# EAGLE design winderController02 (EAGLE 9.3.1)
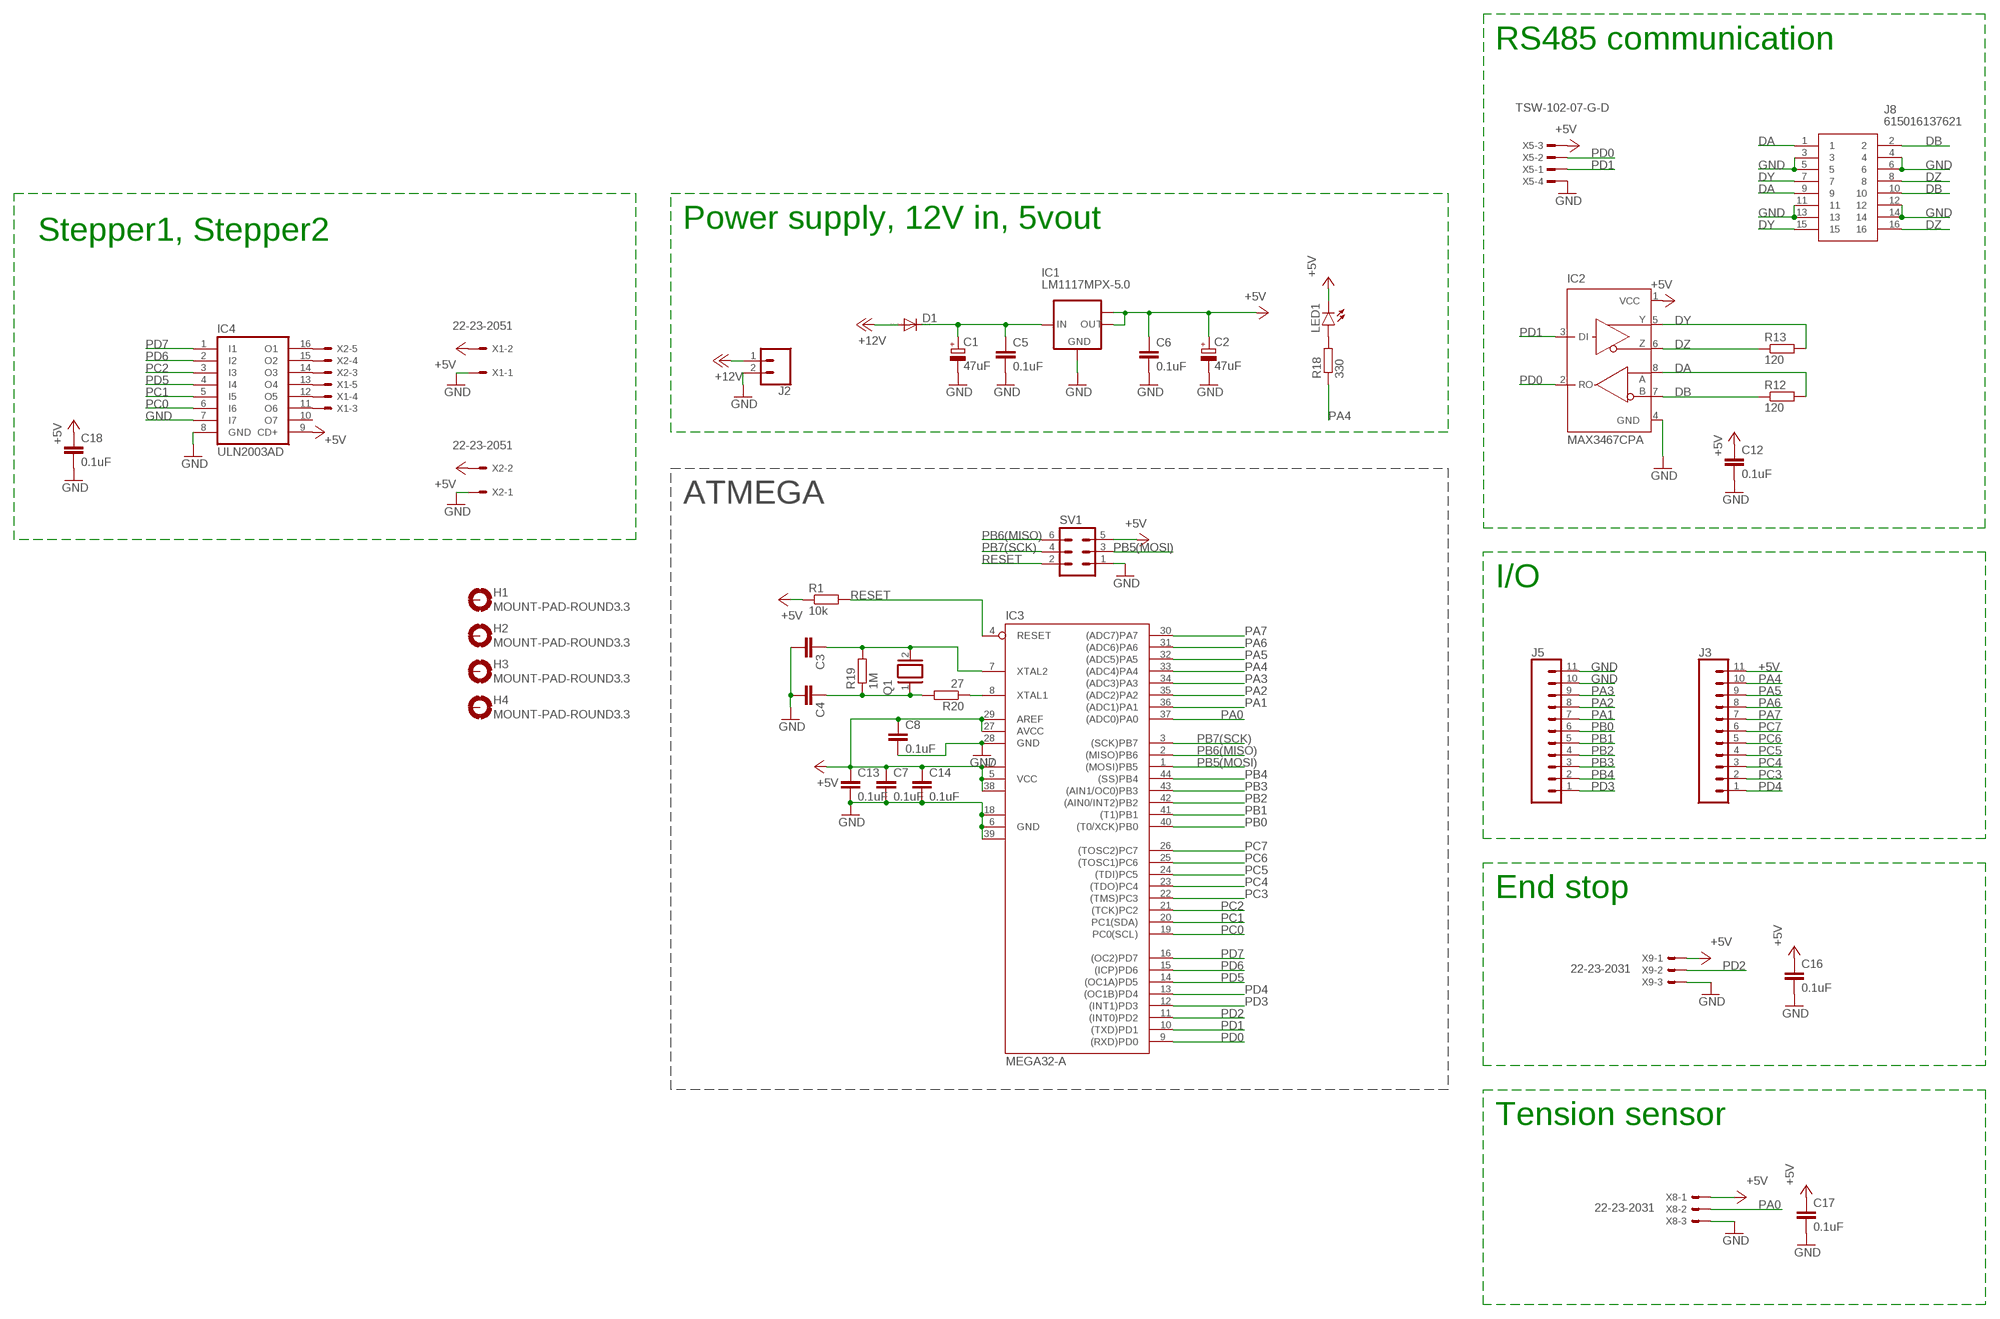
[diagram p0: schematic, sheet 1]

## Parts
C1  47uF  CPOL-EUD  [PANASONIC_D]
C2  47uF  CPOL-EUD  [PANASONIC_D]
C3  C-EUC0603  [C0603]
C4  C-EUC0603  [C0603]
C5  0.1uF  C-EUC0603  [C0603]
C6  0.1uF  C-EUC0603  [C0603]
C7  0.1uF  C-EUC0603  [C0603]
C8  0.1uF  C-EUC0603  [C0603]
C12  0.1uF  C-EUC0603  [C0603]
C13  0.1uF  C-EUC0603  [C0603]
C14  0.1uF  C-EUC0603  [C0603]
C16  0.1uF  C-EUC0603  [C0603]
C17  0.1uF  C-EUC0603  [C0603]
C18  0.1uF  C-EUC0603  [C0603]
D1  DIODE-SMB  [SMB]
H1  MOUNT-PAD-ROUND3.3  [3,3-PAD]
H2  MOUNT-PAD-ROUND3.3  [3,3-PAD]
H3  MOUNT-PAD-ROUND3.3  [3,3-PAD]
H4  MOUNT-PAD-ROUND3.3  [3,3-PAD]
IC1  LM1117MPX-5.0  [SOT223]
IC2  MAX3467CPA  [SO08]
IC3  MEGA32-A  [TQFP44]
IC4  ULN2003AD  [SO16]
J2  CONN_023.5MM  [SCREWTERMINAL-3.5MM-2]
J3  CONN_11  [1X11]
J5  CONN_11  [1X11]
J8  615016137621  [WR-MJ]
LED1  LEDSML1206  [SML1206]
Q1  XTAL/S  [QS]
R1  10k  R-EU_R0805  [R0805]
R12  120  R-EU_R1210  [R1210]
R13  120  R-EU_R1210  [R1210]
R18  330  R-EU_R0805  [R0805]
R19  1M  R-EU_R0805  [R0805]
R20  27  R-EU_R0805  [R0805]
SV1  MA03-2  [MA03-2]
X1  22-23-2051  [22-23-2051]
X2  22-23-2051  [22-23-2051]
X5  TSW-102-07-G-D  [TSW-102-XX-G-D]
X8  22-23-2031  [22-23-2031]
X9  22-23-2031  [22-23-2031]

## Nets
+5V: C2.+ C6.1 C7.1 C8.1 C12.1 C13.1 C14.1 C16.1 C17.1 C18.1 IC1.2(OUT) IC1.TAB(OUT1) IC2.1(VCC) IC3.5(VCC) IC3.17(VCC1) IC3.27(AVCC) IC3.29(AREF) IC3.38(VCC2) IC4.9(CD+) J3.11 LED1.C R1.1 SV1.5 X1.2 X2.2 X5.3 X8.1 X9.1
+12V: D1.A J2.1
DA: IC2.8(A) J8.1 J8.9 R12.2
DB: IC2.7(B) J8.2 J8.10 R12.1
DY: IC2.5(Y) J8.7 J8.15 R13.2
DZ: IC2.6(Z) J8.8 J8.16 R13.1
GND: C1.- C2.- C3.2 C4.2 C5.2 C6.2 C7.2 C8.2 C12.2 C13.2 C14.2 C16.2 C17.2 C18.2 IC1.1(GND) IC2.4(GND) IC3.6(GND) IC3.18(GND1) IC3.28(GND) IC3.39(GND2) IC4.7(I7) IC4.8(GND) J2.2 J5.10 J5.11 J8.3 J8.4 J8.5 J8.6 J8.11 J8.12 J8.13 J8.14 SV1.1 X1.1 X2.1 X5.4 X8.3 X9.3
N$9: IC4.11(O6) X1.3
N$10: IC4.12(O5) X1.4
N$11: IC4.13(O4) X1.5
N$12: IC4.14(O3) X2.3
N$18: C1.+ C5.1 D1.C IC1.3(IN)
N$19: C3.1 IC3.7(XTAL2) Q1.2 R19.2
N$20: C4.1 Q1.1 R19.1 R20.2
N$28: IC4.15(O2) X2.4
N$29: IC4.16(O1) X2.5
N$35: IC3.8(XTAL1) R20.1
N$41: LED1.A R18.2
PA0: IC3.37((ADC0)PA0) X8.2
PA1: IC3.36((ADC1)PA1) J5.7
PA2: IC3.35((ADC2)PA2) J5.8
PA3: IC3.34((ADC3)PA3) J5.9
PA4: IC3.33((ADC4)PA4) J3.10 R18.1
PA5: IC3.32((ADC5)PA5) J3.9
PA6: IC3.31((ADC6)PA6) J3.8
PA7: IC3.30((ADC7)PA7) J3.7
PB0: IC3.40((T0/XCK)PB0) J5.6
PB1: IC3.41((T1)PB1) J5.5
PB2: IC3.42((AIN0/INT2)PB2) J5.4
PB3: IC3.43((AIN1/OC0)PB3) J5.3
PB4: IC3.44((SS)PB4) J5.2
PB5(MOSI): IC3.1((MOSI)PB5) SV1.3
PB6(MISO): IC3.2((MISO)PB6) SV1.6
PB7(SCK): IC3.3((SCK)PB7) SV1.4
PC0: IC3.19(PC0(SCL)) IC4.6(I6)
PC1: IC3.20(PC1(SDA)) IC4.5(I5)
PC2: IC3.21((TCK)PC2) IC4.3(I3)
PC3: IC3.22((TMS)PC3) J3.2
PC4: IC3.23((TDO)PC4) J3.3
PC5: IC3.24((TDI)PC5) J3.4
PC6: IC3.25((TOSC1)PC6) J3.5
PC7: IC3.26((TOSC2)PC7) J3.6
PD0: IC2.2(RO) IC3.9((RXD)PD0) X5.2
PD1: IC2.3(DI) IC3.10((TXD)PD1) X5.1
PD2: IC3.11((INT0)PD2) X9.2
PD3: IC3.12((INT1)PD3) J5.1
PD4: IC3.13((OC1B)PD4) J3.1
PD5: IC3.14((OC1A)PD5) IC4.4(I4)
PD6: IC3.15((ICP)PD6) IC4.2(I2)
PD7: IC3.16((OC2)PD7) IC4.1(I1)
RESET: IC3.4(RESET) R1.2 SV1.2
Unconnected: H1.B3,3(MOUNT) H2.B3,3(MOUNT) H3.B3,3(MOUNT) H4.B3,3(MOUNT) IC4.10(O7)

## Notes on the sheet
- RS485 communication
- Power supply, 12V in, 5vout
- Stepper1, Stepper2
- ATMEGA
- I/O
- End stop
- Tension sensor

## Library data of the parts
C1 C2 = rcl:CPOL-EU: POLARIZED CAPACITOR, European symbol; SPICEPREFIX: C
C3-C8 C12-C14 C16-C18 = rcl:C-EU: CAPACITOR, European symbol; SPICEPREFIX: C
D1 = diode:DIODE-: DIODE
H1-H4 = holes:MOUNT-PAD-ROUND: MOUNTING PAD, round
IC1 = lm1117:LM1117MPX-*
IC2 = maxim:MAX3467*: +5V, Fail-Safe, 40Mbps, Profibus RS-485/RS-422 Transceivers Source: MAX3465-MAX3469.pdf; OC_FARNELL: unknown; OC_NEWARK: unknown
IC3 = atmel:MEGA32: MICROCONTROLLER 32 Kbytes FLASH 2 Kbytes SRAM 1 Kbytes EEPROM USART 8-channel 10 bit ADC Source: www.atmel.com .. doc2503.pdf; MPN: ATMEGA32-16AU; OC_FARNELL: 9171274; OC_NEWARK: 69K6677
IC4 = uln-udn:ULN2003A: DRIVER ARRAY
J2 = SparkFun-Connectors:CONN_02: Multi connection point. Often used as Generic Header-pin footprint for 0.1 inch spaced/style header connections On any of the 0.1 inch spaced packages, you can populate with these: Break Away Headers - Straight <https://www.sparkfun.com/products/116> (PRT-00116) Break Away Male Headers - Right Angle <https://www.sparkfun.com/products/553> (PRT-00553) Female Headers <https://www.sparkfun.com/products/115> (PRT-00115) Break Away Headers - Machine Pin <https://www.sparkfun.com/products/117> (PRT-00117) Break Away Female Headers - Swiss Machine Pin <https://www.sparkfun.com/products/743> (PRT-00743) For SCREWTERMINALS and SPRING TERMINALS visit here: Screw Terimnals on SparkFun.com <https://www.sparkfun.com/search/results?term=Screw+Terminals> (5mm/3.5mm/2.54mm spacing) This device is also useful as a general connection point to wire up your design to another part of your project. Our various solder wires solder well into these plated through hole pads. Hook-Up Wire - Assortment (Stranded, 22 AWG) <https://www.sparkfun.com/products/11375> (PRT-11375) Hook-Up Wire - Assortment (Solid Core, 22 AWG) <https://www.sparkfun.com/products/11367> (PRT-11367) View the entire wire category on our website here <https://www.sparkfun.com/categories/141> Special notes: Molex polarized connector foot print use with: PRT-08233 with associated crimp pins and housings. 2.54_SCREWTERM for use with PRT-10571. 3.5mm Screw Terminal footprints for PRT-08084 5mm Screw Terminal footprints for use with PRT-08432; PROD_ID: CONN-08399
J3 J5 = SparkFun-Connectors:CONN_11: Multi connection point. Often used as Generic Header-pin footprint for 0.1 inch spaced/style header connections On any of the 0.1 inch spaced packages, you can populate with these: Break Away Headers - Straight <https://www.sparkfun.com/products/116> (PRT-00116) Break Away Male Headers - Right Angle <https://www.sparkfun.com/products/553> (PRT-00553) Female Headers <https://www.sparkfun.com/products/115> (PRT-00115) Break Away Headers - Machine Pin <https://www.sparkfun.com/products/117> (PRT-00117) Break Away Female Headers - Swiss Machine Pin <https://www.sparkfun.com/products/743> (PRT-00743) For SCREWTERMINALS and SPRING TERMINALS visit here: Screw Terimnals on SparkFun.com <https://www.sparkfun.com/search/results?term=Screw+Terminals> (5mm/3.5mm/2.54mm spacing) This device is also useful as a general connection point to wire up your design to another part of your project. Our various solder wires solder well into these plated through hole pads. Hook-Up Wire - Assortment (Stranded, 22 AWG) <https://www.sparkfun.com/products/11375> (PRT-11375) Hook-Up Wire - Assortment (Solid Core, 22 AWG) <https://www.sparkfun.com/products/11367> (PRT-11367) View the entire wire category on our website here <https://www.sparkfun.com/categories/141>
J8 = SamacSys_Parts:615016137621: Wurth Elektronik Female Cat5e RJ45 Connector, Shielded, Right Angle, PCB Mount Mount, Source: Datasheet <http://www.mouser.com/datasheet/2/445/615016137621-537831.pdf>; DESCRIPTION: Wurth Elektronik Female Cat5e RJ45 Connector, Shielded, Right Angle, PCB Mount Mount,; HEIGHT: mm; MANUFACTURER_NAME: Wurth Elektronik; MANUFACTURER_PART_NUMBER: 615016137621; MOUSER_PART_NUMBER: 710-615016137621; MOUSER_PRICE-STOCK: https://www.mouser.com/Search/Refine.aspx?Keyword=710-615016137621
LED1 = led:LED: LED OSRAM: - CHIPLED LG R971, LG N971, LY N971, LG Q971, LY Q971, LO R971, LY R971 LH N974, LH R974 LS Q976, LO Q976, LY Q976 LO Q996 - Hyper CHIPLED LW Q18S LB Q993, LB Q99A, LB R99A - SideLED LS A670, LO A670, LY A670, LG A670, LP A670 LB A673, LV A673, LT A673, LW A673 LH A674 LY A675 LS A676, LA A676, LO A676, LY A676, LW A676 LS A679, LY A679, LG A679 - Hyper Micro SIDELED® LS Y876, LA Y876, LO Y876, LY Y876 LT Y87S - SmartLED LW L88C, LW L88S LB L89C, LB L89S, LG L890 LS L89K, LO L89K, LY L89K LS L896, LA L896, LO L896, LY L896 - TOPLED LS T670, LO T670, LY T670, LG T670, LP T670 LSG T670, LSP T670, LSY T670, LOP T670, LYG T670 LG T671, LOG T671, LSG T671 LB T673, LV T673, LT T673, LW T673 LH T674 LS T676, LA T676, LO T676, LY T676, LB T676, LH T676, LSB T676, LW T676 LB T67C, LV T67C, LT T67C, LS T67K, LO T67K, LY T67K, LW E67C LS E67B, LA E67B, LO E67B, LY E67B, LB E67C, LV E67C, LT E67C LW T67C LS T679, LY T679, LG T679 LS T770, LO T770, LY T770, LG T770, LP T770 LB T773, LV T773, LT T773, LW T773 LH T774 LS E675, LA E675, LY E675, LS T675 LS T776, LA T776, LO T776, LY T776, LB T776 LHGB T686 LT T68C, LB T68C - Hyper Mini TOPLED® LB M676 - Mini TOPLED Santana® LG M470 LS M47K, LO M47K, LY M47K Source: http://www.osram.convergy.de LUXEON: - LUMILED® LXK2-PW12-R00, LXK2-PW12-S00, LXK2-PW14-U00, LXK2-PW14-V00 LXK2-PM12-R00, LXK2-PM12-S00, LXK2-PM14-U00 LXK2-PE12-Q00, LXK2-PE12-R00, LXK2-PE12-S00, LXK2-PE14-T00, LXK2-PE14-U00 LXK2-PB12-K00, LXK2-PB12-L00, LXK2-PB12-M00, LXK2-PB14-N00, LXK2-PB14-P00, LXK2-PB14-Q00 LXK2-PR12-L00, LXK2-PR12-M00, LXK2-PR14-Q00, LXK2-PR14-R00 LXK2-PD12-Q00, LXK2-PD12-R00, LXK2-PD12-S00 LXK2-PH12-R00, LXK2-PH12-S00 LXK2-PL12-P00, LXK2-PL12-Q00, LXK2-PL12-R00 Source: www.luxeon.com KINGBRIGHT: KA-3528ASYC Source: www.kingbright.com
Q1 = special:XTAL/S: CRYSTAL; SPICEPREFIX: B
R1 R12 R13 R18-R20 = rcl:R-EU_: RESISTOR, European symbol; SPICEPREFIX: R
SV1 = con-lstb:MA03-2: PIN HEADER; OC_FARNELL: unknown; OC_NEWARK: unknown
X1 X2 = con-molex:22-23-2051: .100" (2.54mm) Center Header - 5 Pin; MF: MOLEX; MPN: 22-23-2051; OC_FARNELL: 1462952; OC_NEWARK: 38C9178
X5 = con-samtec:TSW-102-*-G: THROUGH-HOLE .025" SQ POST HEADER Source: Samtec TSW.pdf; MF: Samtec Inc.; MPN: TSW-102-07-G-D
X8 X9 = con-molex:22-23-2031: .100" (2.54mm) Center Header - 3 Pin; MF: MOLEX; MPN: 22-23-2031; OC_FARNELL: 1462950; OC_NEWARK: 30C0862

## Board
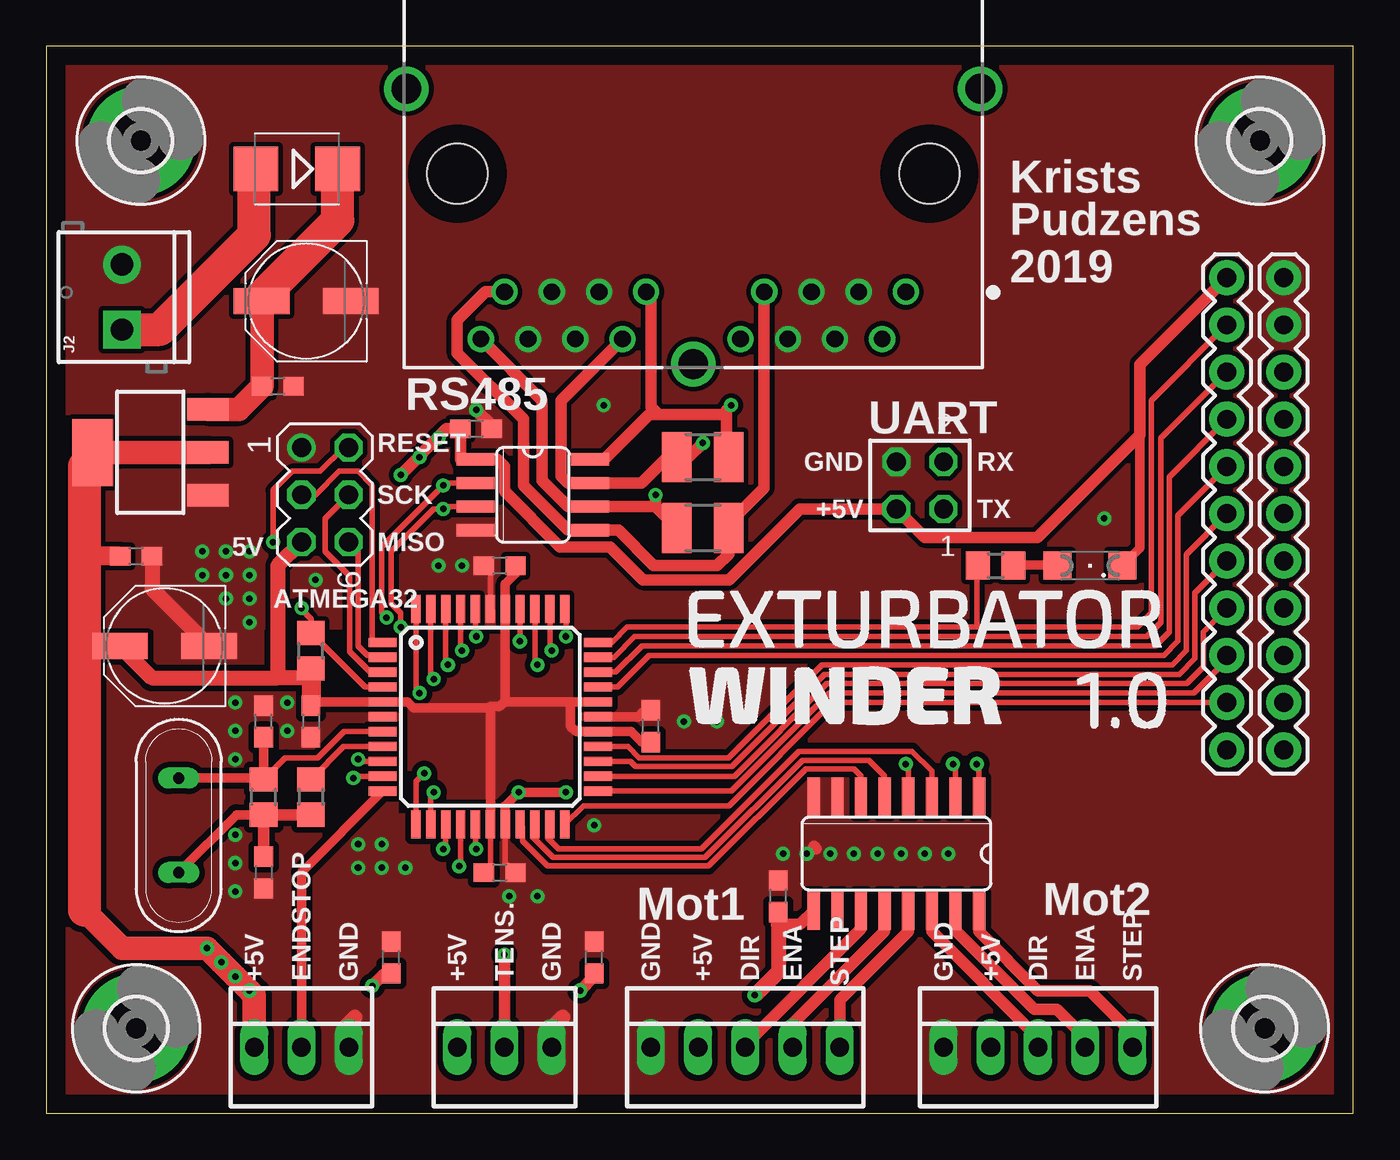
[diagram p1: board, top side]
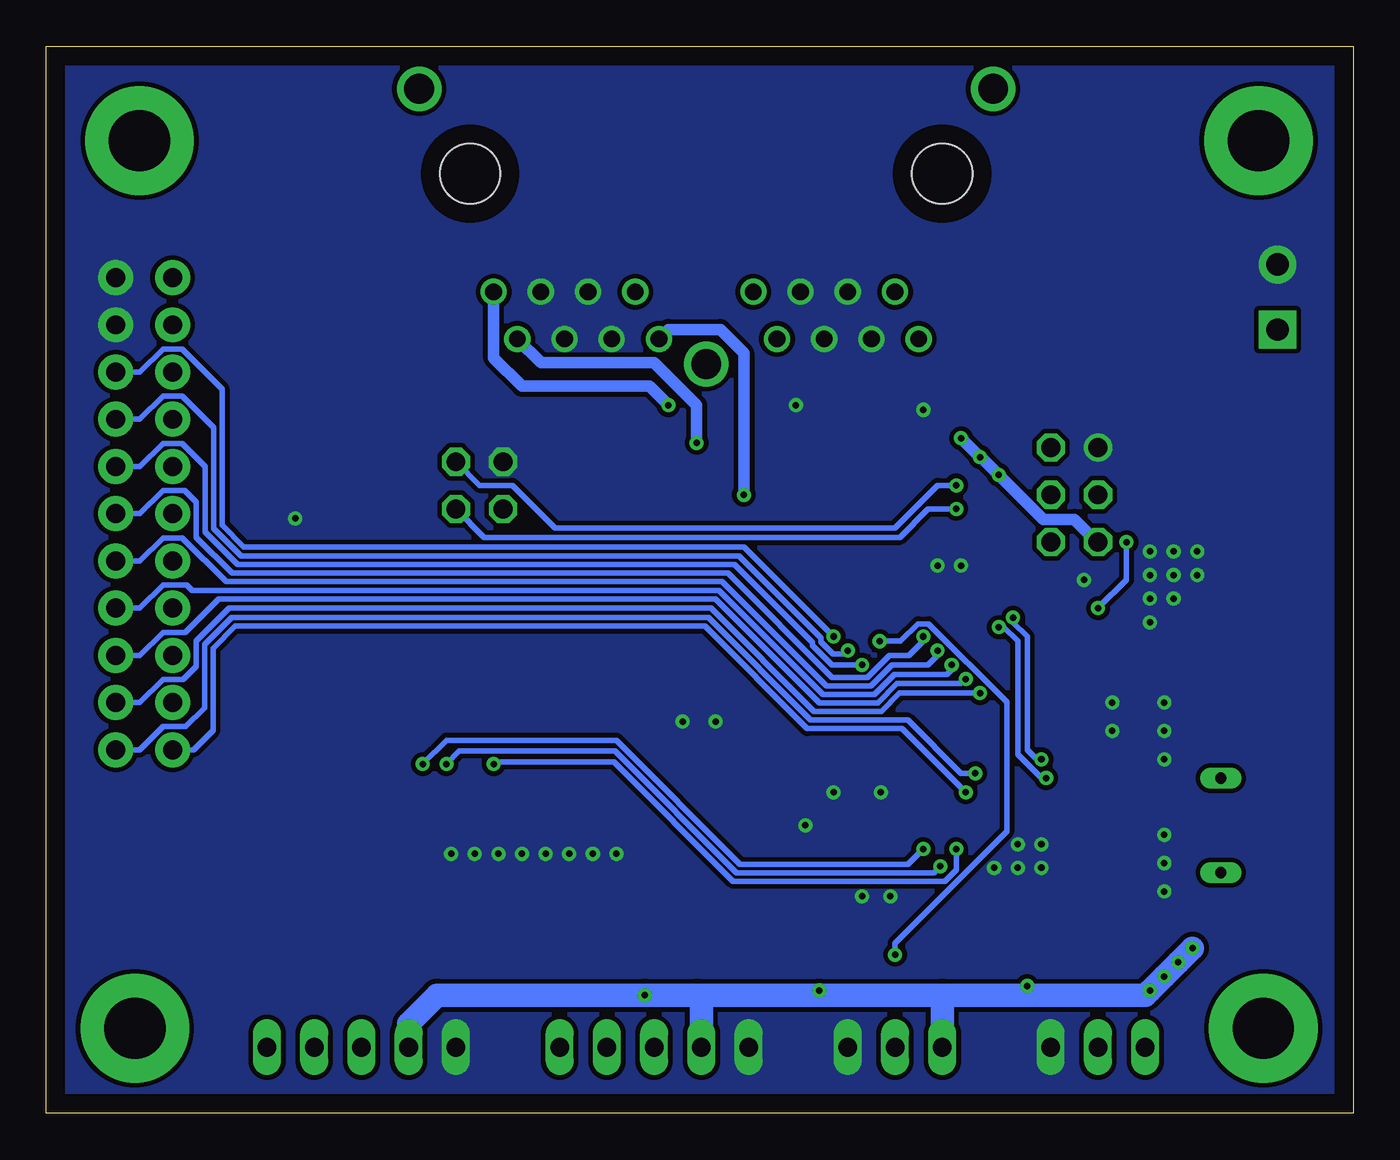
[diagram p2: board, bottom side, seen from below]

Size 70.28 x 57.39 mm. Coordinates in mm from the lower left corner, seen from the top.
Outline: 0,0 70.28,0 70.28,57.39 0,57.39 0,0
Copper layers (1*16): Top 0.035mm / dielectric 1.5mm / Bottom 0.035mm
Design rules "default *": minimum track width 6mil, minimum drill 0.35mm, track to track 6mil, track to pad 6mil, pad to pad 6mil, via to via 6mil, smd to smd 6mil, copper to edge 40mil, drill to drill 6mil, minimum pad ring 10mil, minimum via ring 8mil, stop-mask expansion 10mil, vias tented up to drill 100mil, thermal gap 10mil

### Footprints (pad centres in the part's own frame; a part is rotated, then mirrored left to right if it is on the bottom)
PANASONIC_D = smd 3 x 1.4: + 2.4,0; - -2.4,0
C0603 = smd 1.1 x 1: 1 -0.85,0; 2 0.85,0
SMB = smd 2.4 x 2.4: A 2.2,0; C -2.2,0
3,3-PAD = drill 3.3 pad 5.842: B3,3 0,0
SOT223 = smd 1.219 x 2.235: 1 -2.311,-3.099; 2 0,-3.099; 3 2.311,-3.099 | smd 3.6 x 2.2: TAB 0,3.099
SO08 = smd 0.66 x 2.032: 1 -1.905,-3.073; 2 -0.635,-3.073; 3 0.635,-3.073; 4 1.905,-3.073; 5 1.905,3.073; 6 0.635,3.073; 7 -0.635,3.073; 8 -1.905,3.073
TQFP44 = smd 1.5 x 0.5: 1 -5.8,4; 2 -5.8,3.2; 3 -5.8,2.4; 4 -5.8,1.6; 5 -5.8,0.8; 6 -5.8,0; 7 -5.8,-0.8; 8 -5.8,-1.6; 9 -5.8,-2.4; 10 -5.8,-3.2; 11 -5.8,-4; 23 5.8,-4; 24 5.8,-3.2; 25 5.8,-2.4; 26 5.8,-1.6; 27 5.8,-0.8; 28 5.8,0; 29 5.8,0.8; 30 5.8,1.6; 31 5.8,2.4; 32 5.8,3.2; 33 5.8,4 | smd 0.5 x 1.5: 12 -4,-5.8; 13 -3.2,-5.8; 14 -2.4,-5.8; 15 -1.6,-5.8; 16 -0.8,-5.8; 17 0,-5.8; 18 0.8,-5.8; 19 1.6,-5.8; 20 2.4,-5.8; 21 3.2,-5.8; 22 4,-5.8; 34 4,5.8; 35 3.2,5.8; 36 2.4,5.8; 37 1.6,5.8; 38 0.8,5.8; 39 0,5.8; 40 -0.8,5.8; 41 -1.6,5.8; 42 -2.4,5.8; 43 -3.2,5.8; 44 -4,5.8
SO16 = smd 0.66 x 2.032: 1 -4.445,-3.073; 2 -3.175,-3.073; 3 -1.905,-3.073; 4 -0.635,-3.073; 5 0.635,-3.073; 6 1.905,-3.073; 7 3.175,-3.073; 8 4.445,-3.073; 9 4.445,3.073; 10 3.175,3.073; 11 1.905,3.073; 12 0.635,3.073; 13 -0.635,3.073; 14 -1.905,3.073; 15 -3.175,3.073; 16 -4.445,3.073
SCREWTERMINAL-3.5MM-2 = drill 1.2 pad 2.032 square: 1 0,0 | drill 1.2 pad 2.032: 2 3.5,0
1X11 = drill 1.016 pad 1.88: 1 0,0; 2 2.54,0; 3 5.08,0; 4 7.62,0; 5 10.16,0; 6 12.7,0; 7 15.24,0; 8 17.78,0; 9 20.32,0; 10 22.86,0; 11 25.4,0
WR-MJ = drill 0.9 pad 1.4: 1 -11.43,10.92; 2 -10.16,13.46; 3 -8.89,10.92; 4 -7.62,13.46; 5 -6.35,10.92; 6 -5.08,13.46; 7 -3.81,10.92; 8 -2.54,13.46; 9 2.54,10.92; 10 3.81,13.46; 11 5.08,10.92; 12 6.35,13.46; 13 7.62,10.92; 14 8.89,13.46; 15 10.16,10.92; 16 11.43,13.46 | drill 1.6 pad 2.4: 17 0,14.81; 20 15.435,0; 21 -15.435,0 | hole 3.25: -12.7,4.57; 12.7,4.57
SML1206 = smd 1.5 x 1.5: A 1.75,0; C -1.75,0
QS = drill 0.61 long: 1 -2.54,0; 2 2.54,0
R0805 = smd 1.3 x 1.5: 1 -0.95,0; 2 0.95,0
R1210 = smd 1.6 x 2.7: 1 -1.4,0; 2 1.4,0
MA03-2 = drill 1.016: 1 -2.54,-1.27 | drill 1.016 octagon: 2 -2.54,1.27; 3 0,-1.27; 4 0,1.27; 5 2.54,-1.27; 6 2.54,1.27
22-23-2051 = drill 1 long: 1 -5.08,0; 2 -2.54,0; 3 0,0; 4 2.54,0; 5 5.08,0
TSW-102-XX-G-D = drill 1 pad 1.5 octagon: 1 1.27,-1.27; 2 1.27,1.27; 3 -1.27,-1.27; 4 -1.27,1.27
22-23-2031 = drill 1 long: 1 -2.54,0; 2 0,0; 3 2.54,0

### Placement (x,y rotation side)
C1  13.97,43.69 180 top
C2  6.35,25.15 180 top
C3  11.68,21.08 90 top
C4  11.68,12.95 270 top
C5  12.45,39.12 0 top
C6  14.22,21.08 270 top
C7  24.38,29.46 180 top
C8  32.51,20.83 90 top
C12  23.11,36.83 0 top
C13  18.54,8.38 90 top
C14  29.46,8.38 90 top
C16  4.83,29.97 0 top
C17  39.37,11.68 90 top
C18  24.38,12.95 0 top
D1  13.46,50.8 180 top
H1  65.53,4.57 0 top
H2  5.08,52.32 0 top
H3  65.28,52.32 0 top
H4  4.83,4.57 0 top
IC1  5.59,35.56 90 top
IC2  26.16,33.27 270 top
IC3  23.88,21.34 0 top
IC4  45.72,13.97 180 top
J2  4.06,42.16 90 top
J3  63.5,19.56 90 top
J5  66.55,19.56 90 top
J8  34.8,55.12 180 top
LED1  56.13,29.46 180 top
Q1  7.11,15.49 90 top
R1  14.22,24.89 90 top
R12  35.31,35.31 0 top
R13  35.31,31.5 0 top
R18  51.05,29.46 0 top
R19  11.68,17.02 90 top
R20  14.22,17.02 270 top
SV1  14.99,33.27 270 top
X1  37.59,3.56 0 top
X2  53.34,3.56 0 top
X5  46.99,33.78 0 top
X8  24.64,3.56 0 top
X9  13.72,3.56 0 top

### Tracks (layer width: path | path; a pad name or v marks a point on that pad's centre or on a via)
+5V  (via drill 0.35)
  Top 0.305: 2.79,35.56 IC1.TAB | IC3.17 23.88,13.3 C18.1 | IC3.29 29.21,22.14 28.23,22.14 28.19,22.1
  Top 0.508: 23.88,21.88 24.38,21.88 24.64,22.14 | 24.64,22.14 28.19,22.14 | 28.19,22.14 29.21,22.14 | 24.64,22.14 24.68,22.17 IC3.38 24.68,28.49 25.23,29.04 C7.1 | IC3.17 23.88,21.82 19.74,21.82 19.43,22.14 IC3.5 14.44,22.14 14.22,22.35 C6.1 | C8.1 32,19.98 31.45,20.54 IC3.27 28.49,20.54 28.19,20.83 28.19,22.14 | 58.83,36.5 58.83,30.41 LED1.C
  Top 0.61: IC4.9 40.54,10.16 39.37,10.16 | C13.1 18.14,7.48 v17.53,6.86 | C14.1 29.46,7.37 v28.7,6.6 | J3.11 58.83,40.28 58.83,36.5 53.31,30.99 47.24,30.99 X5.3 40.52,32.51 36.71,28.7 32.09,28.7 30.32,30.48 27.62,30.48 24.64,33.47 24.64,34.8 24.26,35.18 IC2.1 22.26,35.18 C12.1 21.54,36.83 v19.05,34.34
  Top 0.813: C2.+ 5.66,23.43 12.45,23.43 | R1.1 13.72,23.43 12.45,23.43 | SV1.5 12.45,29.46 12.45,23.43 | C17.1 39.37,10.16 39.37,7.62 v38.1,6.35
  Top 1.016: R1.1 14.22,22.35 | C16.1 2.03,29.97
  Top 1.27: 2.03,10.92 4.06,8.89 v8.64,8.89 v9.4,8.13 v10.16,7.37 v10.92,6.6 11.18,6.35 X9.1 | 2.03,34.8 2.79,35.56 | IC1.2 IC1.TAB | C2.+ 2.03,25.15
  Top 1.778: 2.03,34.8 2.03,29.97 2.03,25.15 2.03,10.92
  Bottom 0.61: SV1.5 13.77,30.73 14.99,31.95 16.66,31.95 v19.05,34.34 20.01,35.31 v20.07,35.31 v21.08,36.32 | v17.53,6.86 17.53,6.35 | v28.7,6.6 28.7,6.35
  Bottom 1.27: X2.2 50.8,4.83 49.28,6.35 v38.1,6.35 35.31,6.35 | 35.31,6.35 28.7,6.35 22.1,6.35 | 22.1,6.35 17.53,6.35 11.18,6.35 v10.92,6.6 v10.16,7.37 v9.4,8.13 v8.64,8.89 | X8.1 22.1,6.35 | X1.2 35.05,6.1 35.31,6.35
  pour Top (isolate 0.305, no thermals): 19.56,25.65 28.19,25.65 28.19,17.02 19.56,17.02
+12V
  Top 1.524: 11.43,50.63 D1.A
  Top 1.778: J2.1 6.1,42.16 11.18,47.24 11.18,50.71 D1.A
DA  (via drill 0.35)
  Top 0.61: IC2.8 30,35.18 32.41,37.59 32.92,37.59 | 32.92,37.59 36.58,37.59 | 36.58,37.59 36.58,37.85 v36.83,38.1 | 36.58,37.59 36.58,35.44 R12.2 | 32.92,37.59 32.51,38 32.51,43.94 J8.9
  Bottom 0.61: v36.83,38.1 37.85,39.12 44.7,39.12 46.23,40.64 J8.1
DB  (via drill 0.35)
  Top 0.61: v35.31,36.07 34.54,35.31 R12.1 33.4,35.31 32,33.91 IC2.7 28.07,33.91 27.69,34.29 27.69,38.36 J8.10
  Bottom 0.61: J8.2 43.69,40.39 37.59,40.39 35.31,38.1 v35.31,36.07
DY
  Top 0.61: J8.7 38.61,33.65 36.71,31.75 R13.2 36.71,30.1 36.07,29.46 32.66,29.46 30.76,31.37 IC2.5 28.07,31.37 25.65,33.78 25.65,37.34 22.1,40.89 22.1,42.67 23.62,44.2 J8.15
DZ  (via drill 0.35)
  Top 0.61: v32.77,33.27 32.77,32.64 R13.1 32.76,32.64 IC2.6 28.07,32.64 26.67,34.04 26.67,38.36 J8.16
  Bottom 0.61: J8.8 36.83,42.17 34.04,42.17 32.77,40.89 v32.77,33.27
GND  (via drill 0.35)
  Top 0.305: IC3.39 23.88,29.17 23.56,29.49 C7.2 | IC3.18 24.68,13.51 C18.2 25.49,12.7 | 32.17,21.34 C8.2 32.6,21.59 32.09,21.59 | 12.95,20.49 v12.95,20.57
  Top 0.508: IC3.28 31.84,21.34 32.09,21.59 | IC3.18 24.68,16.55 v25.4,17.27 v27.94,17.27
  Top 0.61: v23.11,37.85 23.96,37 C12.2 | 41.27,14.35 41.4,14.22 | C17.2 39.46,12.53
  Top 0.813: C16.2 5.68,28.22 C2.- | 16.6,5.17 16,4.57 16,3.81 X9.3 | 27.77,5.17 27.18,4.57 X8.3
  other vias: 24.89,11.68 34.29,21.08 22.35,29.46 10.16,22.1 29.97,38.1 29.46,15.49 39.62,13.97 40.89,13.97 42.16,13.97 43.43,13.97 44.7,13.97 45.97,13.97 36.07,21.08 26.42,11.68 21.08,29.46 12.95,22.1 10.16,20.57 19.3,13.21 16.76,14.48 10.92,26.42 10.92,27.69 10.92,28.96 10.92,30.23 9.65,28.96 9.65,27.69 9.65,30.23 8.38,30.23 8.38,28.96 18.03,14.48 18.03,13.21 16.76,13.21 56.9,32 14.48,28.7 47.24,13.97 48.51,13.97 10.16,11.94 10.16,13.46 10.16,19.05 10.16,14.99
  pour Bottom (isolate 0.254, no thermals): 0.25,57.4 0.25,0.25 70.1,0.25 70.1,57.4
  pour Top (isolate 0.254, no thermals): 0.25,57.4 70.1,57.4 70.1,26.16 0.25,26.16
  pour Top (isolate 0.305, no thermals): 0.25,0.25 69.85,0.25 69.85,26.16 28.96,26.16 28.96,16 18.8,16 18.8,26.16 0.25,26.16
N$9
  Top 0.61: X1.3 37.59,3.7 43.81,9.92 IC4.11
N$10
  Top 0.61: X1.4 40.13,4.83 45.09,9.78 IC4.12
N$11
  Top 0.61: X1.5 42.67,6.1 46.35,9.78 IC4.13
N$12
  Top 0.61: IC4.14 47.62,9.78 53.34,4.06 X2.3
N$18
  Top 1.27: IC1.3 10.35,37.87 C5.1 11.6,43.66 C1.+
  Top 1.778: C1.+ 11.57,43.94 15.66,48.03 D1.C
N$19
  Top 0.305: R19.2 12.84,19.12 14.6,19.12 16.01,20.54 IC3.7
  Top 0.508: Q1.2 11.62,18.03 R19.2 C3.1
N$20
  Top 0.508: Q1.1 10.23,16.07 R19.1
  Top 0.61: C4.1 R19.1 R20.2
N$28
  Top 0.61: IC4.15 48.9,9.84 53.15,5.59 54.36,5.59 55.88,4.06 X2.4
N$29
  Top 0.61: IC4.16 50.16,9.78 53.34,6.6 56.13,6.6 58.42,4.32 X2.5
N$35
  Top 0.305: IC3.8 15.99,19.74 R20.1
N$41
  Top 0.508: R18.2 52.04,29.5 54.35,29.5 LED1.A
PA0  (via drill 0.35)
  Top 0.305: IC3.37 25.48,25.41 v25.46,25.4
  Top 0.61: v24.64,8.53 X8.2
  Bottom 0.305: v24.64,8.53 24.64,9.15 18.62,15.16 18.62,22.13 22.83,26.34 23.4,26.34 24.33,25.4 v25.46,25.4
PA1  (via drill 0.35)
  Top 0.305: IC3.36 26.28,24.27 v26.42,24.13
  Bottom 0.305: v26.42,24.13 28.03,24.13 29.08,25.18 29.08,25.32 33.27,29.52 59.99,29.52 61.75,31.27 61.75,34.81 62.98,36.04 64.02,36.04 65.26,34.8 J5.7
PA2  (via drill 0.35)
  Top 0.305: IC3.35 27.08,24.99 v27.18,24.89
  Bottom 0.305: v27.18,24.89 27.35,24.72 27.97,24.72 28.62,25.37 28.62,25.57 33.02,29.97 59.8,29.97 61.29,31.46 61.29,36.89 62.98,38.58 64.02,38.58 65.26,37.34 J5.8
PA3  (via drill 0.35)
  Top 0.305: IC3.34 27.94,27.07 v27.94,25.65
  Bottom 0.305: v27.94,25.65 32.77,30.48 59.67,30.48 60.83,31.65 60.83,38.97 62.98,41.12 64.02,41.12 65.26,39.88 J5.9
PA4
  Top 0.305: IC3.33 30.42,25.34 31.24,26.16 50.04,26.16 | J3.10 59.44,38.35 59.44,26.92 58.67,26.16 50.04,26.16 | R18.1 50.04,29.4 50.04,26.16
PA5
  Top 0.305: IC3.32 30.52,24.54 31.64,25.65 59.18,25.65 59.94,26.42 59.94,36.32 J3.9
PA6
  Top 0.305: IC3.31 30.62,23.74 32.03,25.15 59.64,25.15 60.4,25.91 60.4,34.24 J3.8
PA7
  Top 0.305: IC3.30 30.72,22.94 32.42,24.64 60.1,24.64 60.86,25.4 60.86,32.16 J3.7
PB0  (via drill 0.35)
  Top 0.305: IC3.40 23.08,25.69 v23.11,25.65
  Bottom 0.305: v23.11,25.65 23.11,25.4 23.88,24.64 24.94,24.64 26.13,23.45 28.02,23.45 33.63,29.06 60.3,29.06 62.23,30.99 62.23,32.88 62.85,33.5 64.02,33.5 65.26,32.26 J5.6
PB1  (via drill 0.35)
  Top 0.305: IC3.41 22.28,24.97 v22.35,24.89
  Bottom 0.305: v22.35,24.89 22.35,24.64 22.86,24.13 24.8,24.13 25.94,22.99 28.32,22.99 33.93,28.6 60.62,28.6 62.98,30.96 64.02,30.96 65.26,29.72 J5.5
PB2  (via drill 0.35)
  Top 0.305: IC3.42 21.48,24.24 v21.59,24.13
  Bottom 0.305: v21.59,24.13 21.59,23.88 21.84,23.62 24.66,23.62 25.75,22.53 28.51,22.53 34.1,28.12 43.87,28.12 | J5.4 65.26,27.18 64.02,28.42 62.73,28.42 62.43,28.12 43.87,28.12 | 43.87,28.12
PB3  (via drill 0.35)
  Top 0.305: IC3.43 20.68,23.52 v20.83,23.37
  Bottom 0.305: v20.83,23.37 21.08,23.11 24.53,23.11 25.57,22.07 28.7,22.07 34.3,27.67 61.02,27.67 62.81,25.88 64.02,25.88 65.26,24.64 J5.3
PB4  (via drill 0.35)
  Top 0.305: IC3.44 19.88,22.8 v20.07,22.61
  Bottom 0.305: v20.07,22.61 24.39,22.61 25.38,21.62 28.98,21.62 34.54,27.18 60.45,27.18 62.23,25.4 62.23,24.04 62.92,23.34 64.02,23.34 65.26,22.1 J5.2
PB5(MOSI)
  Top 0.305: SV1.3 14.48,33.27 15.75,34.54 16.76,34.54 17.53,33.78 17.53,25.4 17.59,25.34 IC3.1
PB6(MISO)
  Top 0.305: SV1.6 16.76,30.23 16.76,25.15 17.27,24.64 17.97,24.64 IC3.2
PB7(SCK)
  Top 0.305: SV1.4 14.99,32 14.99,30.21 16.3,28.9 16.3,24.85 17.41,23.74 IC3.3
PC0
  Top 0.305: IC4.6 43.81,18.16 43.43,18.54 40.84,18.54 35.6,13.3 26.95,13.3 25.6,14.65 25.6,15.41 IC3.19
PC1
  Top 0.305: IC3.20 26.15,15.41 26.15,14.86 27.26,13.76 35.41,13.76 40.65,19 44.25,19 45.09,18.16 IC4.5
PC2
  Top 0.305: IC3.21 26.95,15.41 26.95,14.83 27.56,14.22 35.23,14.22 40.49,19.48 46.56,19.48 47.62,18.41 IC4.3
PC3
  Top 0.305: IC3.22 28.89,16.55 36.71,16.55 42.26,22.1 J3.2
PC4
  Top 0.305: IC3.23 36.85,17.34 42.12,22.61 61.72,22.61 63.5,24.38 J3.3
PC5
  Top 0.305: IC3.24 37,18.14 41.98,23.11 61.33,23.11 62.23,24.02 62.23,25.91 J3.4
PC6
  Top 0.305: IC3.25 31.43,18.94 31.7,18.67 36.88,18.67 41.84,23.62 60.94,23.62 61.77,24.46 61.77,27.99 J3.5
PC7
  Top 0.305: IC3.26 31.27,19.74 31.89,19.12 36.7,19.12 41.7,24.13 60.55,24.13 61.32,24.89 61.32,30.07 J3.6
PD0  (via drill 0.35)
  Top 0.305: IC3.9 16.88,18.94 v16.76,19.05 | IC2.2 21.46,33.91 v21.34,33.78 18.03,30.48 18.03,26.92 v18.29,26.67
  Bottom 0.305: v16.76,19.05 17.02,19.05 17.53,19.56 17.53,25.65 18.29,26.42 v18.29,26.67 | X5.2 46.99,33.78 45.21,33.78 42.93,31.5 24.64,31.5 22.35,33.78 v21.34,33.78
PD1  (via drill 0.35)
  Top 0.305: IC3.10 16.61,18.14 v16.51,18.03 | IC2.3 21.46,32.64 v21.34,32.51 20.83,32.51 18.54,30.23 18.54,27.43 19.05,26.92 v19.05,26.16
  Bottom 0.305: v16.51,18.03 16.76,18.03 18.03,19.3 18.03,25.4 18.8,26.16 v19.05,26.16 | X5.1 46.74,30.99 24.38,30.99 22.86,32.51 v21.34,32.51
PD2
  Top 0.508: IC3.11 13.72,12.98 X9.2
PD3  (via drill 0.35)
  Top 0.305: IC3.12 19.88,17.84 v20.32,18.29
  Bottom 0.305: v20.32,18.29 21.08,18.29 23.95,21.16 29.17,21.16 34.68,26.67 60.31,26.67 61.77,25.21 61.77,21.82 62.79,20.8 64.02,20.8 65.26,19.56 J5.1
PD4  (via drill 0.35)
  Top 0.305: IC3.13 20.68,17.12 v20.83,17.27
  Bottom 0.305: v20.83,17.27 24.26,20.7 29.36,20.7 34.87,26.21 60.12,26.21 61.32,25.02 61.32,20.61 62.37,19.56 J3.1
PD5  (via drill 0.35)
  Top 0.305: IC3.14 21.48,14.36 v21.34,14.22 | v46.23,18.8 46.35,18.67 IC4.4
  Bottom 0.305: v21.34,14.22 21.34,13.09 21.94,12.49 33.34,12.49 39.76,18.91 46.11,18.91 v46.23,18.8
PD6  (via drill 0.35)
  Top 0.305: IC3.15 22.28,13.37 v22.2,13.29 | IC4.2 48.9,18.67 v48.77,18.8
  Bottom 0.305: v22.2,13.29 22.55,12.95 33.15,12.95 39.69,19.49 48.08,19.49 v48.77,18.8
PD7  (via drill 0.35)
  Top 0.305: IC3.16 23.08,14.26 v23.11,14.22 | v50.04,18.8 50.16,18.67 IC4.1
  Bottom 0.305: v23.11,14.22 23.93,13.41 32.96,13.41 39.62,20.07 48.77,20.07 v50.04,18.8
RESET  (via drill 0.35)
  Top 0.305: IC3.4 17.13,22.94 R1.2 14.22,26.6 13.72,27.11 v13.72,27.18 | SV1.2 16,35.81 14.73,34.54 13.21,34.54 12.19,33.53 v12.19,30.73
  Bottom 0.305: v13.72,27.18 12.19,28.7 v12.19,30.73

### Text on the board
tNames: Krists | Pudzens | 2019 | RS485 | UART | RESET | GND | RX | +5V | SCK | TX | 5V | MISO | ATMEGA32 | Mot1 | Mot2 | +5V | ENDSTOP | GND | +5V | TENS. | GND | GND | +5V | DIR | ENA | GND | +5V | DIR | ENA | STEP | STEP